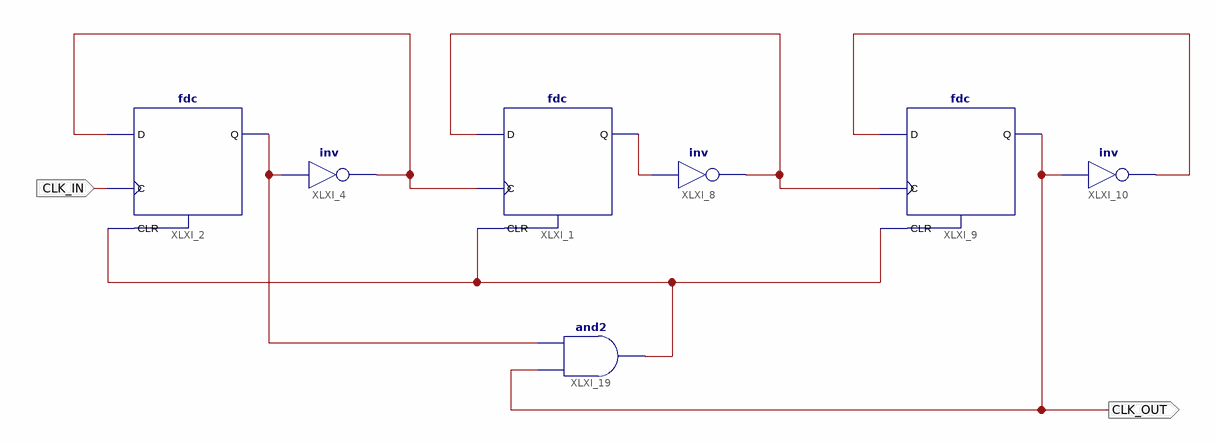
[diagram p0: schematic sheet 1]
// Xilinx ISE schematic Div5.sch (spartan6) as structural Verilog: 7 symbols, 2 ports
module Div5 (
  input  CLK_IN,
  output CLK_OUT
);

  wire XLXN_1, XLXN_12, XLXN_13, XLXN_14, XLXN_17, XLXN_20;

  fdc XLXI_1 (.C(XLXN_12), .CLR(XLXN_20), .D(XLXN_13), .Q(XLXN_1));
  fdc XLXI_2 (.C(CLK_IN), .CLR(XLXN_20), .D(XLXN_12), .Q(XLXN_17));
  not XLXI_8 (XLXN_13, XLXN_1);
  not XLXI_4 (XLXN_12, XLXN_17);
  fdc XLXI_9 (.C(XLXN_13), .CLR(XLXN_20), .D(XLXN_14), .Q(CLK_OUT));
  not XLXI_10 (XLXN_14, CLK_OUT);
  and XLXI_19 (XLXN_20, CLK_OUT, XLXN_17);
endmodule
